# Altium project mod_x_cb_g3399.PrjPCB
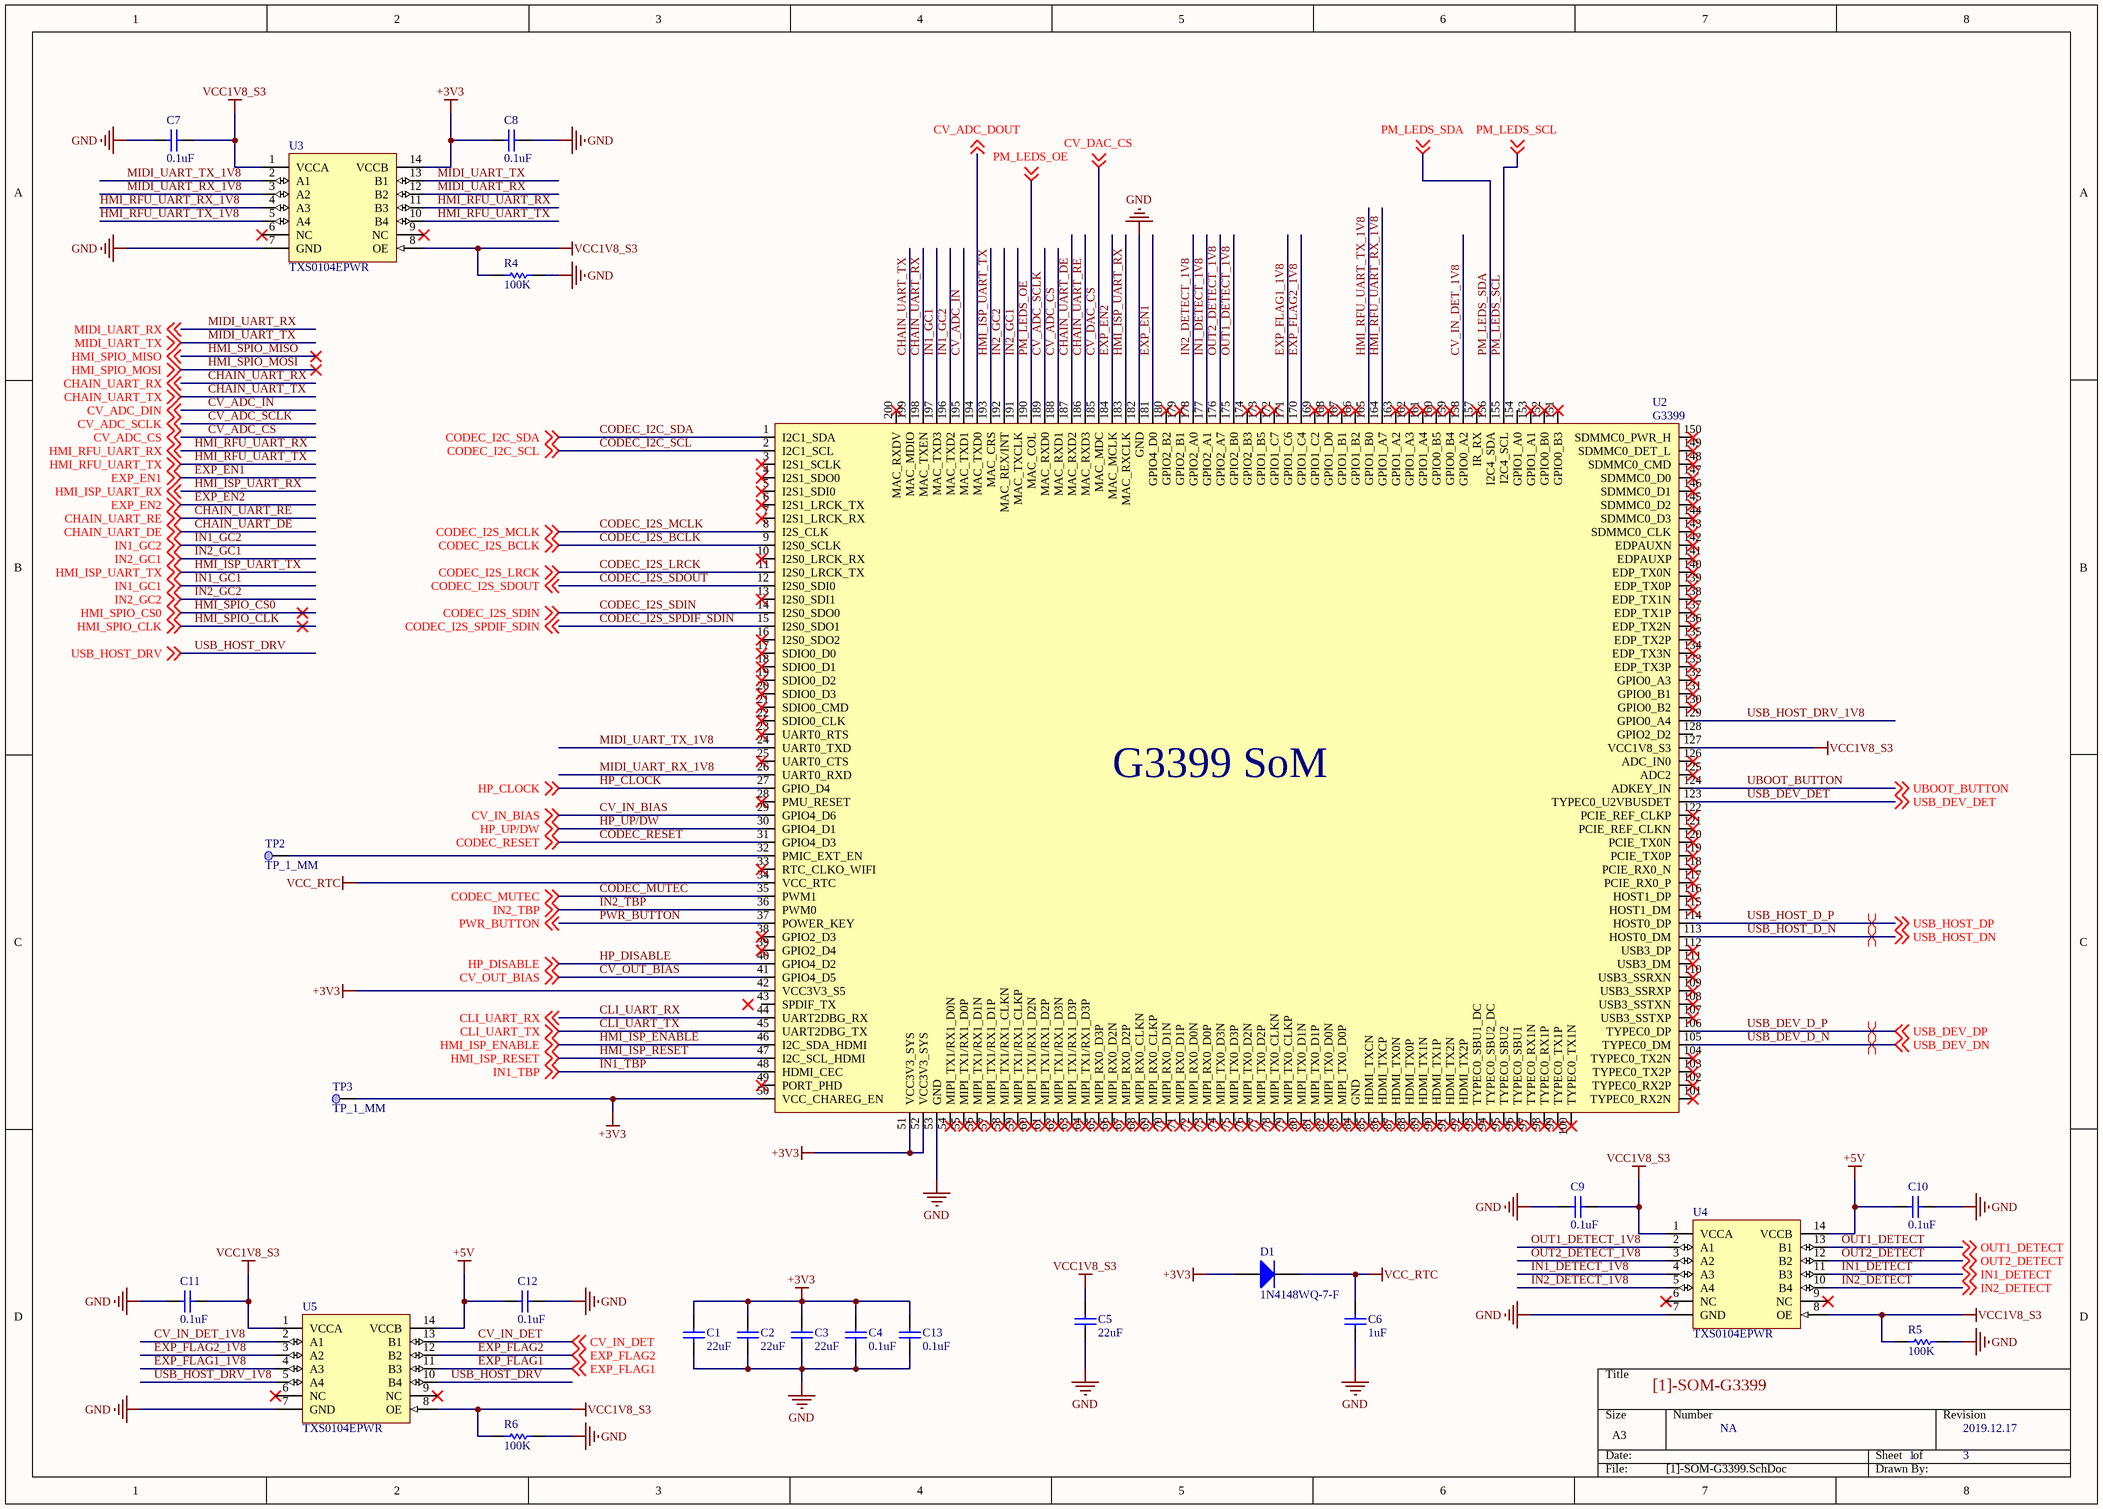
[diagram p0: [1]-SOM-G3399.SchDoc]
3 sheets, 34 parts. Net scope: global (net labels, ports and power ports of the same name join across sheets).
Board file: mod_duo_x_g3399.PcbDoc
Sheets:
  [1]-SOM-G3399.SchDoc
  [2]-INTERFACE_CONNS.SchDoc
  [3]-DCDC-3V3.SchDoc

## Sheet [1]-SOM-G3399.SchDoc: [1]-SOM-G3399
size A3; DocumentNumber: NA; Revision: 2019.12.17; SheetNumber: 1; SheetTotal: 3

### Parts
C1  22uF  [CAPC1608N]
C2  22uF  [CAPC1608N]
C3  22uF  [CAPC1608N]
C4  0.1uF  [CAPC1005N]
C5  22uF  [CAPC1608N]
C6  1uF  [CAPC1005N]
C7  0.1uF  [CAPC1005N]
C8  0.1uF  [CAPC1005N]
C9  0.1uF  [CAPC1005N]
C10  0.1uF  [CAPC1005N]
C11  0.1uF  [CAPC1005N]
C12  0.1uF  [CAPC1005N]
C13  0.1uF  [CAPC1005N]
D1  1N4148WQ-7-F  [SOD123]
R4  100K  [RESC1005N]
R5  100K  [RESC1005N]
R6  100K  [RESC1005N]
TP2  TP_1_MM  [TP_1_MM]  (no BOM)
TP3  TP_1_MM  [TP_1_MM]  (no BOM)
U2  G3399  [G3399-MOD]
U3  TXS0104EPWR  [TSSOP_PW14]
U4  TXS0104EPWR  [TSSOP_PW14]
U5  TXS0104EPWR  [TSSOP_PW14]

### Nets
+3V3: C1.2 C2.2 C3.2 C4.2 C8.2 C13.2 D1.2(A) TP3.1 U2.42(VCC3V3_S5) U2.50(VCC_CHAREG_EN) U2.51(VCC3V3_SYS) U2.52(VCC3V3_SYS) U3.14(VCCB)
+5V: C10.2 C12.2 U4.14(VCCB) U5.14(VCCB)
GND: C1.1 C2.1 C3.1 C4.1 C5.1 C6.1 C7.1 C8.1 C9.1 C10.1 C11.1 C12.1 C13.1 R4.2 R5.2 R6.1 U2.53(GND) U2.182(GND) U3.7(GND) U4.7(GND) U5.7(GND)
VCC1V8_S3: C5.2 C7.2 C9.2 C11.2 R4.1 R5.1 R6.2 U2.127(VCC1V8_S3) U3.1(VCCA) U3.8(OE) U4.1(VCCA) U4.8(OE) U5.1(VCCA) U5.8(OE)
VCC_RTC: C6.2 D1.1(K) U2.34(VCC_RTC)
CHAIN_UART_DE: U2.187(MAC_RXD2) ; off-sheet CHAIN_UART_DE
CHAIN_UART_RE: U2.186(MAC_RXD3) ; off-sheet CHAIN_UART_RE
CHAIN_UART_RX: U2.198(MAC_TXEN) ; off-sheet CHAIN_UART_RX
CHAIN_UART_TX: U2.199(MAC_MDIO) ; off-sheet CHAIN_UART_TX
CLI_UART_RX: U2.44(UART2DBG_RX) ; off-sheet CLI_UART_RX
CLI_UART_TX: U2.45(UART2DBG_TX) ; off-sheet CLI_UART_TX
CODEC_I2C_SCL: U2.2(I2C1_SCL) ; off-sheet CODEC_I2C_SCL
CODEC_I2C_SDA: U2.1(I2C1_SDA) ; off-sheet CODEC_I2C_SDA
CODEC_I2S_BCLK: U2.9(I2S0_SCLK) ; off-sheet CODEC_I2S_BCLK
CODEC_I2S_LRCK: U2.11(I2S0_LRCK_TX) ; off-sheet CODEC_I2S_LRCK
CODEC_I2S_MCLK: U2.8(I2S_CLK) ; off-sheet CODEC_I2S_MCLK
CODEC_I2S_SDIN: U2.14(I2S0_SDO0) ; off-sheet CODEC_I2S_SDIN
CODEC_I2S_SDOUT: U2.12(I2S0_SDI0) ; off-sheet CODEC_I2S_SDOUT
CODEC_I2S_SPDIF_SDIN: U2.15(I2S0_SDO1) ; off-sheet CODEC_I2S_SPDIF_SDIN
CODEC_MUTEC: U2.35(PWM1) ; off-sheet CODEC_MUTEC
CODEC_RESET: U2.31(GPIO4_D3) ; off-sheet CODEC_RESET
CV_ADC_CS: U2.188(MAC_RXD1) ; off-sheet CV_ADC_CS
CV_ADC_DIN: U2.195(MAC_TXD1) ; off-sheet CV_ADC_DIN  [also labelled CV_ADC_IN]
CV_ADC_DOUT: U2.194(MAC_TXD0) ; off-sheet CV_ADC_DOUT
CV_ADC_SCLK: U2.189(MAC_RXD0) ; off-sheet CV_ADC_SCLK
CV_DAC_CS: U2.185(MAC_MDC) ; off-sheet CV_DAC_CS
CV_IN_BIAS: U2.29(GPIO4_D6) ; off-sheet CV_IN_BIAS
CV_IN_DET: U5.13(B1) ; off-sheet CV_IN_DET
CV_IN_DET_1V8: U2.158(GPIO0_A2) U5.2(A1)
CV_OUT_BIAS: U2.41(GPIO4_D5) ; off-sheet CV_OUT_BIAS
EXP_EN1: U2.181(GPIO4_D0) ; off-sheet EXP_EN1
EXP_EN2: U2.184(MAC_MCLK) ; off-sheet EXP_EN2
EXP_FLAG1: U5.11(B3) ; off-sheet EXP_FLAG1
EXP_FLAG1_1V8: U2.171(GPIO1_C6) U5.4(A3)
EXP_FLAG2: U5.12(B2) ; off-sheet EXP_FLAG2
EXP_FLAG2_1V8: U2.170(GPIO1_C4) U5.3(A2)
HMI_ISP_ENABLE: U2.46(I2C_SDA_HDMI) ; off-sheet HMI_ISP_ENABLE
HMI_ISP_RESET: U2.47(I2C_SCL_HDMI) ; off-sheet HMI_ISP_RESET
HMI_ISP_UART_RX: U2.183(MAC_RXCLK) ; off-sheet HMI_ISP_UART_RX
HMI_ISP_UART_TX: U2.193(MAC_CRS) ; off-sheet HMI_ISP_UART_TX
HMI_RFU_UART_RX: U3.11(B3) ; off-sheet HMI_RFU_UART_RX
HMI_RFU_UART_RX_1V8: U2.164(GPIO1_A7) U3.4(A3)
HMI_RFU_UART_TX: U3.10(B4) ; off-sheet HMI_RFU_UART_TX
HMI_RFU_UART_TX_1V8: U2.165(GPIO1_B0) U3.5(A4)
HP_CLOCK: U2.27(GPIO_D4) ; off-sheet HP_CLOCK
HP_DISABLE: U2.40(GPIO4_D2) ; off-sheet HP_DISABLE
HP_UP/DW: U2.30(GPIO4_D1) ; off-sheet HP_UP/DW
IN1_DETECT: U4.11(B3) ; off-sheet IN1_DETECT
IN1_DETECT_1V8: U2.177(GPIO2_A1) U4.4(A3)
IN1_GC1: U2.197(MAC_TXD3) ; off-sheet IN1_GC1
IN1_GC2: U2.196(MAC_TXD2) ; off-sheet IN1_GC2
IN1_TBP: U2.48(HDMI_CEC) ; off-sheet IN1_TBP
IN2_DETECT: U4.10(B4) ; off-sheet IN2_DETECT
IN2_DETECT_1V8: U2.178(GPIO2_A0) U4.5(A4)
IN2_GC1: U2.191(MAC_TXCLK) ; off-sheet IN2_GC1
IN2_GC2: U2.192(MAC_REX/INT) ; off-sheet IN2_GC2
IN2_TBP: U2.36(PWM0) ; off-sheet IN2_TBP
MIDI_UART_RX: U3.12(B2) ; off-sheet MIDI_UART_RX
MIDI_UART_RX_1V8: U2.26(UART0_RXD) U3.3(A2)
MIDI_UART_TX: U3.13(B1) ; off-sheet MIDI_UART_TX
MIDI_UART_TX_1V8: U2.24(UART0_TXD) U3.2(A1)
OUT1_DETECT: U4.13(B1) ; off-sheet OUT1_DETECT
OUT1_DETECT_1V8: U2.175(GPIO2_B0) U4.2(A1)
OUT2_DETECT: U4.12(B2) ; off-sheet OUT2_DETECT
OUT2_DETECT_1V8: U2.176(GPIO2_A7) U4.3(A2)
PM_LEDS_OE: U2.190(MAC_COL) ; off-sheet PM_LEDS_OE
PM_LEDS_SCL: U2.155(I2C4_SCL) ; off-sheet PM_LEDS_SCL
PM_LEDS_SDA: U2.156(I2C4_SDA) ; off-sheet PM_LEDS_SDA
PWR_BUTTON: U2.37(POWER_KEY) ; off-sheet PWR_BUTTON
UBOOT_BUTTON: U2.124(ADKEY_IN) ; off-sheet UBOOT_BUTTON
USB_DEV_D_N: U2.105(TYPEC0_DM) ; off-sheet USB_DEV_DN  [also labelled USB_DEV_DN]
USB_DEV_D_P: U2.106(TYPEC0_DP) ; off-sheet USB_DEV_DP  [also labelled USB_DEV_DP]
USB_DEV_DET: U2.123(TYPEC0_U2VBUSDET) ; off-sheet USB_DEV_DET
USB_HOST_D_N: U2.113(HOST0_DM) ; off-sheet USB_HOST_DN  [also labelled USB_HOST_DN]
USB_HOST_D_P: U2.114(HOST0_DP) ; off-sheet USB_HOST_DP  [also labelled USB_HOST_DP]
USB_HOST_DRV: U5.10(B4) ; off-sheet USB_HOST_DRV
USB_HOST_DRV_1V8: U2.129(GPIO0_A4) U5.5(A4)
NetTP2_1: TP2.1 U2.32(PMIC_EXT_EN)

Not connected (* = marked no-connect by the designer): U2 3(I2S1_SCLK)* 4(I2S1_SDO0)* 5(I2S1_SDI0)* 6(I2S1_LRCK_TX)* 7(I2S1_LRCK_RX)* 10(I2S0_LRCK_RX)* 13(I2S0_SDI1)* 16(I2S0_SDO2)* 17(SDIO0_D0)* 18(SDIO0_D1)* 19(SDIO0_D2)* 20(SDIO0_D3)* 21(SDIO0_CMD)* 22(SDIO0_CLK)* 23(UART0_RTS)* 25(UART0_CTS)* 28(PMU_RESET)* 33(RTC_CLKO_WIFI)* 38(GPIO2_D3)* 39(GPIO2_D4)* 43(SPDIF_TX) 49(PORT_PHD)* 54(MIPI_TX1/RX1_D0N)* 55(MIPI_TX1/RX1_D0P)* 56(MIPI_TX1/RX1_D1N)* 57(MIPI_TX1/RX1_D1P)* 58(MIPI_TX1/RX1_CLKN)* 59(MIPI_TX1/RX1_CLKP)* 60(MIPI_TX1/RX1_D2N)* 61(MIPI_TX1/RX1_D2P)* 62(MIPI_TX1/RX1_D3N)* 63(MIPI_TX1/RX1_D3P)* 64(MIPI_TX1/RX1_D3P)* 65(MIPI_RX0_D3P)* 66(MIPI_RX0_D2N)* 67(MIPI_RX0_D2P)* 68(MIPI_RX0_CLKN)* 69(MIPI_RX0_CLKP)* 70(MIPI_RX0_D1N)* 71(MIPI_RX0_D1P)* 72(MIPI_RX0_D0N)* 73(MIPI_RX0_D0P)* 74(MIPI_TX0_D3N)* 75(MIPI_TX0_D3P)* 76(MIPI_TX0_D2N)* 77(MIPI_TX0_D2P)* 78(MIPI_TX0_CLKN)* 79(MIPI_TX0_CLKP)* 80(MIPI_TX0_D1N)* 81(MIPI_TX0_D1P)* 82(MIPI_TX0_D0N)* 83(MIPI_TX0_D0P)* 84(GND)* 85(HDMI_TXCN)* 86(HDMI_TXCP)* 87(HDMI_TX0N)* 88(HDMI_TX0P)* 89(HDMI_TX1N)* 90(HDMI_TX1P)* 91(HDMI_TX2N)* 92(HDMI_TX2P)* 93(TYPEC0_SBU1_DC)* 94(TYPEC0_SBU2_DC)* 95(TYPEC0_SBU2)* 96(TYPEC0_SBU1)* 97(TYPEC0_RX1N)* 98(TYPEC0_RX1P)* 99(TYPEC0_TX1P)* 100(TYPEC0_TX1N)* 101(TYPEC0_RX2N)* 102(TYPEC0_RX2P)* 103(TYPEC0_TX2P)* 104(TYPEC0_TX2N)* 107(USB3_SSTXP)* 108(USB3_SSTXN)* 109(USB3_SSRXP)* 110(USB3_SSRXN)* 111(USB3_DM)* 112(USB3_DP)* 115(HOST1_DM)* 116(HOST1_DP)* 117(PCIE_RX0_P)* 118(PCIE_RX0_N)* 119(PCIE_TX0P)* 120(PCIE_TX0N)* 121(PCIE_REF_CLKN)* 122(PCIE_REF_CLKP)* 125(ADC2)* 126(ADC_IN0)* 128(GPIO2_D2) 130(GPIO0_B2)* 131(GPIO0_B1)* 132(GPIO0_A3)* 133(EDP_TX3P)* 134(EDP_TX3N)* 135(EDP_TX2P)* 136(EDP_TX2N)* 137(EDP_TX1P)* 138(EDP_TX1N)* 139(EDP_TX0P)* 140(EDP_TX0N)* 141(EDPAUXP)* 142(EDPAUXN)* 143(SDMMC0_CLK)* 144(SDMMC0_D3)* 145(SDMMC0_D2)* 146(SDMMC0_D1)* 147(SDMMC0_D0)* 148(SDMMC0_CMD)* 149(SDMMC0_DET_L)* 150(SDMMC0_PWR_H)* 151(GPIO0_B3)* 152(GPIO0_B0)* 153(GPIO1_A1)* 154(GPIO1_A0) 157(IR_RX)* 159(GPIO0_B4)* 160(GPIO0_B5)* 161(GPIO1_A4)* 162(GPIO1_A3)* 163(GPIO1_A2)* 166(GPIO1_B2)* 167(GPIO1_B1)* 168(GPIO1_D0)* 169(GPIO1_C2)* 172(GPIO1_C7)* 173(GPIO1_B5)* 174(GPIO2_B3)* 179(GPIO2_B1)* 180(GPIO2_B2)* 200(MAC_RXDV)*; U3 6(NC)* 9(NC)*; U4 6(NC)* 9(NC)*; U5 6(NC)* 9(NC)*

### Layout directives
differential pair: USB_DEV_D_N, USB_DEV_D_P, USB_HOST_D_N, USB_HOST_D_P

### Notes on the sheet
- (in symbol G3399) G3399 SoM

### Library data of the parts
C1-C3 C5 = GRM188R60J226MEA0D: CAP CER 22UF 6.3V X5R 0603; Manufacturer 1: Murata; Tolerance: 20%; Supplier 1: Digi-Key; Manufacturer Part Number 1: GRM188R60J226MEA0D; Stock 1: 40000; Pricing 1: 1=0.26, 10=0.177, 100=0.1001, 500=0.07066, 1000=0.06182 (USD); Mount: Surface Mount; Case/Package: 0603; Weight: 0.000222oz; Case Code (Metric): 1608; Case Code (Imperial): 0603; Min Operating Temperature: -55°C; Max Operating Temperature: 85°C; Capacitance: 22uF; Packaging: Tape and Reel; Package Quantity: 4000; Voltage Rating: 6.3V; Dielectric: X5R; Termination: SMD/SMT; Voltage Rating (DC): 6.3V; Length: 1.6mm; Height: 0.8mm; Width: 0.8mm; Thickness: 0.039inch; Depth: 0.8mm; REACH SVHC: No SVHC; Lead Free: Lead Free; ComponentLink1URL: https://www.murata.com/~/media/webrenewal/support/library/catalog/products/capacitor/mlcc/c02e.ashx?la=en-us; ComponentLink1Description: https://www.murata.com/~/media/webrenewal/support/library/catalog/products/capacitor/mlcc/c02e.ashx?la=en-us; Supplier Part Number 1: 490-7611-1-ND
C4 C7-C13 = GRM155R71H104KE14D: CAP CER 0.1UF 50V X7R 0402; Manufacturer 1: Murata; Description 1: Cap Ceramic 0.1uF 50V X7R 10% SMD 0402 125C Paper T/R; Voltage Rating DC: 50 VDC; Tolerance: 10 %; Brand: Murata Electronics; Capacitance - nF: 100 nF; Capacitance - pF: 100000 pF; Class: Class 2; Type: General Purpose Ceramic Capacitors; Unit Weight: 0.000212 oz; Supplier 1: Digi-Key; Manufacturer Part Number 1: GRM155R71H104KE14D; Stock 1: 0; Pricing 1: 1=0.1, 10=0.022, 100=0.0099, 500=0.0071, 1000=0.0056, 2500=0.0051, 5000=0.0047 (USD); Product Category: Multilayer Ceramic Capacitors MLCC - SMD/SMT; RoHS: True; Capacitance: 0.1 uF; Dielectric: X7R; Case Code - in: 0402; Case Code - mm: 1005; Height: 0.5 mm; Maximum Operating Temperature: + 125 C; Minimum Operating Temperature: - 55 C; Product: General Type MLCCs; Series: GRM; Packaging: Reel; Length: 1 mm; Package / Case: 0402 (1005 metric); Factory Pack Quantity: 10000; Termination Style: SMD/SMT; Width: 0.5 mm; ComponentLink1URL: http://components.arrow.com/part/dataview/0323_07030614; ComponentLink1Description: http://components.arrow.com/part/dataview/0323_07030614; ComponentLink2URL: http://psearch.en.murata.com/capacitor/product/GRM155R71H104KE14%23.pdf; ComponentLink2Description: http://psearch.en.murata.com/capacitor/product/GRM155R71H104KE14%23.pdf; ComponentLink3URL: http://www.mouser.com/ds/2/281/c02e-2905.pdf; ComponentLink3Description: http://www.mouser.com/ds/2/281/c02e-2905.pdf; ComponentLink4URL: http://search.murata.co.jp/Ceramy/image/img/A01X/partnumbering_e_01.pdf; ComponentLink4Description: http://search.murata.co.jp/Ceramy/image/img/A01X/partnumbering_e_01.pdf; ComponentLink5URL: http://www.farnell.com/datasheets/2079156.pdf; ComponentLink5Description: http://www.farnell.com/datasheets/2079156.pdf; Supplier Part Number 1: 490-10700-1-ND
C6 = C0402C105K9PACTU: CAP CER 1UF 6.3V X5R 0402; Manufacturer 1: KEMET; Product Training Modules: Capacitor Basics- Typical Uses for Capacitors; Capacitance: 1µF; Tolerance: ±10%; Online Catalog: X5R Dielectric (Commercial Grade); Kits: 399-5085-ND  - KIT CER HI CAPACITANCE CHIP CAPS; Other Names: 399-4873-1; Supplier 1: Digi-Key; Manufacturer Part Number 1: C0402C105K9PACTU; Description 1: CAP CER 1UF 6.3V X5R 0402; Stock 1: 0; Pricing 1: 1=0.1, 10=0.022, 100=0.0097, 500=0.007, 1000=0.0055, 2500=0.005, 5000=0.0046 (USD); Standard Package: 1; Category: Capacitors; Family: Ceramic Capacitors; Series: C; Packaging: Cut Tape (CT); Voltage - Rated: 6.3V; Temperature Coefficient: X5R; Mounting Type: Surface Mount, MLCC; Operating Temperature: -55°C ~ 85°C; Applications: General Purpose; Ratings: -; Package / Case: 0402 (1005 Metric); Size / Dimension: 0.039" L x 0.020" W (1.00mm x 0.50mm); Height - Seated (Max): -; Thickness (Max): 0.022" (0.55mm); Lead Spacing: -; Features: -; Lead Style: -; ComponentLink1URL: https://datasheet.ciiva.com/144/docfinderpartnumber-c0402c105k9pactu-144529.pdf; ComponentLink1Description: https://datasheet.ciiva.com/144/docfinderpartnumber-c0402c105k9pactu-144529.pdf; ComponentLink2URL: https://datasheet.ciiva.com/28645/1789732-28645392.pdf; ComponentLink2Description: https://datasheet.ciiva.com/28645/1789732-28645392.pdf; ComponentLink3URL: https://datasheet.ciiva.com/7747/40889-7747623.pdf; ComponentLink3Description: https://datasheet.ciiva.com/7747/40889-7747623.pdf; ComponentLink4URL: https://datasheet.ciiva.com/18192/getdatasheetpartid-127800-18192427.pdf; ComponentLink4Description: https://datasheet.ciiva.com/18192/getdatasheetpartid-127800-18192427.pdf; ComponentLink5URL: https://datasheet.ciiva.com/7747/kem-c1006-x5r-smd-7747445.pdf; ComponentLink5Description: https://datasheet.ciiva.com/7747/kem-c1006-x5r-smd-7747445.pdf; ComponentLink6URL: https://datasheet.ciiva.com/5414/kem-c1006-x5r-smd-5414919.pdf; ComponentLink6Description: https://datasheet.ciiva.com/5414/kem-c1006-x5r-smd-5414919.pdf; Supplier Part Number 1: 399-4873-1-ND
D1 = 1N4148WQ-7-F: DIODE GEN PURP 100V 300MA SOD123; Manufacturer 1: Diodes Zetex; Max Surge Current: 2A; Forward Voltage: 1.25V; Element Configuration: Single; Recovery Time: 4ns; Peak Reverse Current: 50uA; Max Power Dissipation: 400mW; Supplier 1: Digi-Key; Manufacturer Part Number 1: 1N4148WQ-7-F; Stock 1: 65303; Pricing 1: 1=0.22, 10=0.196, 100=0.107, 500=0.06582, 1000=0.04488 (USD); Mount: Surface Mount; Case/Package: SOD-123-2; Number of Pins: 2; Weight: 0.000353oz; Contact Plating: Matte,Tin; Min Operating Temperature: -65°C; Max Operating Temperature: 150°C; Packaging: Tape and Reel; Peak Non-Repetitive Surge Current: 2A; Forward Current: 300mA; Package Quantity: 3000; Reverse Recovery Time: 4ns; Max Repetitive Reverse Voltage (Vrrm): 100V; Lead Free: Lead Free; Supplier Part Number 1: 1N4148WQ-7-FDICT-ND
R4-R6 = RC0402FR-07100KL: RES SMD 100K OHM 1% 1/16W 0402; Manufacturer 1: Yageo; Resistance: 100 kOhms; Power Rating: 62.5 mW (1/16 W); Voltage Rating: 50 V; Temperature Coefficient: 100 PPM / C; Supplier 1: Digi-Key; Manufacturer Part Number 1: RC0402FR-07100KL; Description 1: RES SMD 100K OHM 1% 1/16W 0402; Stock 1: 10691398; Pricing 1: 1=0.1, 10=0.014, 100=0.0056, 1000=0.0025, 2500=0.0022, 5000=0.0018 (USD); Termination Style: SMD/SMT; Product: Thick Film Resistors General Purpose; Tolerance: 1 %; Case Code - in: 0402; Case Code - mm: 1005; Series: RC; Operating Temperature Range: - 55 C to + 155 C; Packaging: Reel; ComponentLink1URL: https://datasheet.ciiva.com/11819/0900766b80c66297-11819452.pdf; ComponentLink1Description: https://datasheet.ciiva.com/11819/0900766b80c66297-11819452.pdf; ComponentLink2URL: https://datasheet.ciiva.com/16740/pyu-rc0402-51-rohs-l-6-r-16740567.pdf; ComponentLink2Description: https://datasheet.ciiva.com/16740/pyu-rc0402-51-rohs-l-6-r-16740567.pdf; ComponentLink3URL: https://datasheet.ciiva.com/12667/pyu-rc0402-51-rohs-l-6-r-12667930.pdf; ComponentLink3Description: https://datasheet.ciiva.com/12667/pyu-rc0402-51-rohs-l-6-r-12667930.pdf; ComponentLink4URL: https://datasheet.ciiva.com/2453/pyu-r-int-thick-7-2453361.pdf; ComponentLink4Description: https://datasheet.ciiva.com/2453/pyu-r-int-thick-7-2453361.pdf; ComponentLink5URL: https://datasheet.ciiva.com/15189/getdatasheetpartid-323696-15189334.pdf; ComponentLink5Description: https://datasheet.ciiva.com/15189/getdatasheetpartid-323696-15189334.pdf; ComponentLink6URL: https://datasheet.ciiva.com/2453/pyu-r-int-thick-7-2453362.pdf; ComponentLink6Description: https://datasheet.ciiva.com/2453/pyu-r-int-thick-7-2453362.pdf; ComponentLink7URL: https://datasheet.ciiva.com/2453/pyu-r-int-thick-7-2453363.pdf; ComponentLink7Description: https://datasheet.ciiva.com/2453/pyu-r-int-thick-7-2453363.pdf; ComponentLink8URL: https://datasheet.ciiva.com/22747/1018594-22747509.pdf; ComponentLink8Description: https://datasheet.ciiva.com/22747/1018594-22747509.pdf; Supplier Part Number 1: 311-100KLRCT-ND
U2 = G3399: ROCKCHIP R3399 SoM
U3-U5 = IC_TXS0104EPWRG4: IC TRNSLTR BIDIRECTIONAL 14TSSOP; Manufacturer 1: Texas Instruments; Max Supply Voltage: 5.5V; Min Supply Voltage: 2.3V; Propagation Delay: 260ns; Data Rate: 24Mbps; Number of Channels: 4; Logic Function: Translator; High Level Output Current: -20uA; Low Level Output Current: 1mA; Quiescent Current: 14.4uA; Output Type: Voltage; Supplier 1: Digi-Key; Stock 1: 1124; Pricing 1: 1=1.35000, 10=1.20300, 100=0.93810, 500=0.77498, 1000=0.61182 (USD); RoHS: Yes; Mount: Surface Mount; Case/Package: TSSOP; Number of Pins: 14; Weight: 0.002018oz; Min Operating Temperature: -40°C; Max Operating Temperature: 85°C; Packaging: Tape and Reel; Package Quantity: 2000; Number of Bits: 4; Turn-On Delay Time: 260ns; Length: 5mm; Height: 1.15mm; Width: 4.4mm; Radiation Hardening: No; Lead Free: Lead Free; ComponentLink1URL: https://datasheet.ciiva.com/4834/sces651d-126957-4834816.pdf?src-supplier=Mouser; ComponentLink1Description: https://datasheet.ciiva.com/4834/sces651d-126957-4834816.pdf?src-supplier=Mouser; ComponentLink2URL: https://datasheet.ciiva.com/15096/getdatasheetpartid-394723-15096293.pdf?src-supplier=Verical; ComponentLink2Description: https://datasheet.ciiva.com/15096/getdatasheetpartid-394723-15096293.pdf?src-supplier=Verical; ComponentLink3URL: https://datasheet.ciiva.com/26039/txs0104e-26039590.pdf?src-supplier=Avnet+Europe; ComponentLink3Description: https://datasheet.ciiva.com/26039/txs0104e-26039590.pdf?src-supplier=Avnet+Europe; ComponentLink4URL: https://datasheet.ciiva.com/14287/txs0104e-14287679.pdf?src-supplier=Avnet; ComponentLink4Description: https://datasheet.ciiva.com/14287/txs0104e-14287679.pdf?src-supplier=Avnet; ComponentLink5URL: https://datasheet.ciiva.com/1900/txs0104e-1900897.pdf?src-supplier=Digi-Key; ComponentLink5Description: https://datasheet.ciiva.com/1900/txs0104e-1900897.pdf?src-supplier=Digi-Key; Supplier Part Number 1: 296-52841-1-ND; Manufacturer Part Number 1: TXS0104EPWRG4

## Sheet [2]-INTERFACE_CONNS.SchDoc: [2]-INTERFACE_CONNS
size A3; DocumentNumber: NA; Revision: 2019.12.17; SheetNumber: 2; SheetTotal: 3
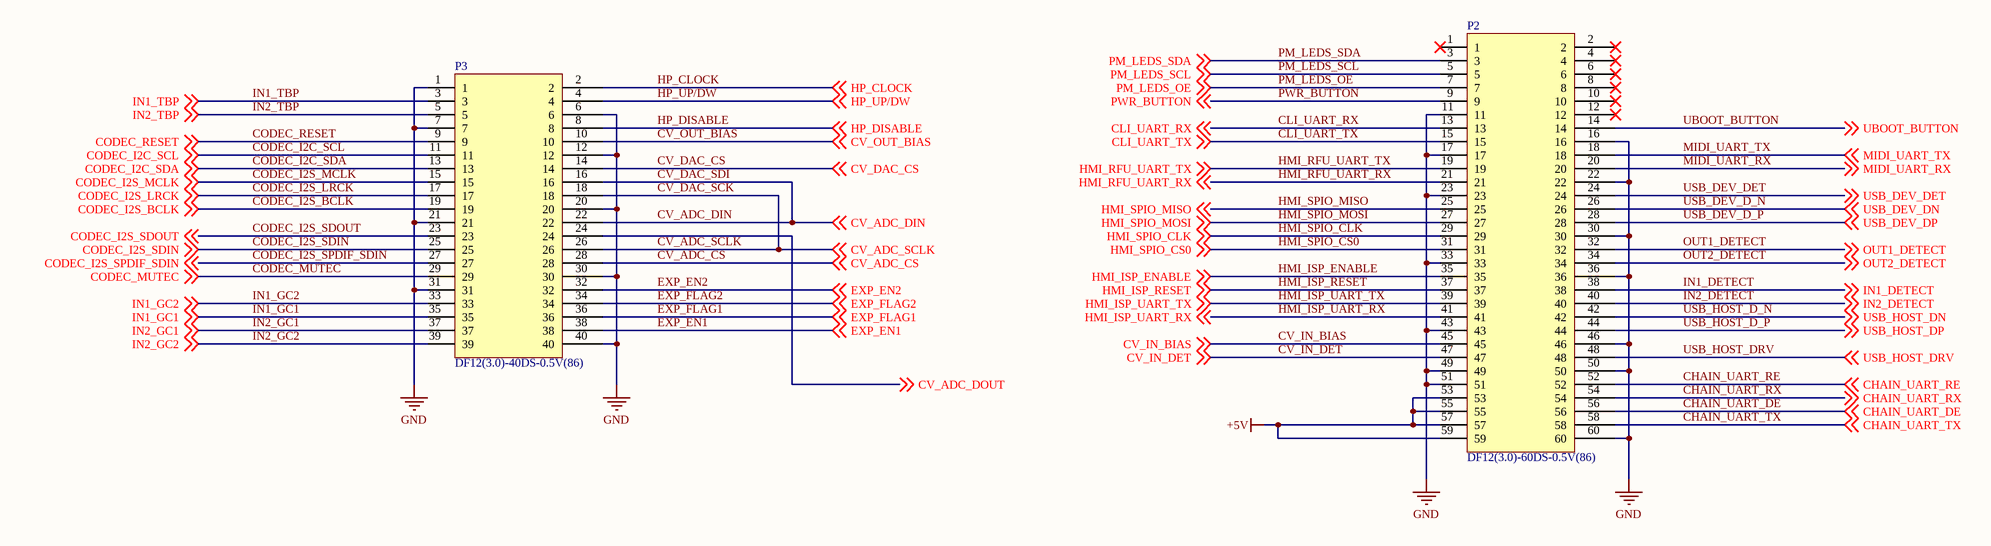
[diagram p1: [2]-INTERFACE_CONNS.SchDoc]

### Parts
P2  DF12(3.0)-60DS-0.5V(86)  [DF12-60]
P3  DF12(3.0)-40DS-0.5V(86)  [DF12-40]

### Nets
+5V: P2.53 P2.55 P2.57 P2.59
GND: P2.11 P2.16 P2.17 P2.22 P2.23 P2.30 P2.33 P2.36 P2.43 P2.46 P2.49 P2.50 P2.51 P2.60 P3.1 P3.6 P3.7 P3.12 P3.20 P3.21 P3.30 P3.31 P3.40
CHAIN_UART_DE: P2.56 ; off-sheet CHAIN_UART_DE
CHAIN_UART_RE: P2.52 ; off-sheet CHAIN_UART_RE
CHAIN_UART_RX: P2.54 ; off-sheet CHAIN_UART_RX
CHAIN_UART_TX: P2.58 ; off-sheet CHAIN_UART_TX
CLI_UART_RX: P2.13 ; off-sheet CLI_UART_RX
CLI_UART_TX: P2.15 ; off-sheet CLI_UART_TX
CODEC_I2C_SCL: P3.11 ; off-sheet CODEC_I2C_SCL
CODEC_I2C_SDA: P3.13 ; off-sheet CODEC_I2C_SDA
CODEC_I2S_BCLK: P3.19 ; off-sheet CODEC_I2S_BCLK
CODEC_I2S_LRCK: P3.17 ; off-sheet CODEC_I2S_LRCK
CODEC_I2S_MCLK: P3.15 ; off-sheet CODEC_I2S_MCLK
CODEC_I2S_SDIN: P3.25 ; off-sheet CODEC_I2S_SDIN
CODEC_I2S_SDOUT: P3.23 ; off-sheet CODEC_I2S_SDOUT
CODEC_I2S_SPDIF_SDIN: P3.27 ; off-sheet CODEC_I2S_SPDIF_SDIN
CODEC_MUTEC: P3.29 ; off-sheet CODEC_MUTEC
CODEC_RESET: P3.9 ; off-sheet CODEC_RESET
CV_ADC_CS: P3.28 ; off-sheet CV_ADC_CS
CV_ADC_DIN: P3.16 P3.22 ; off-sheet CV_ADC_DIN  [also labelled CV_DAC_SDI]
CV_ADC_DOUT: P3.24 ; off-sheet CV_ADC_DOUT
CV_ADC_SCLK: P3.18 P3.26 ; off-sheet CV_ADC_SCLK  [also labelled CV_DAC_SCK]
CV_DAC_CS: P3.14 ; off-sheet CV_DAC_CS
CV_IN_BIAS: P2.45 ; off-sheet CV_IN_BIAS
CV_IN_DET: P2.47 ; off-sheet CV_IN_DET
CV_OUT_BIAS: P3.10 ; off-sheet CV_OUT_BIAS
EXP_EN1: P3.38 ; off-sheet EXP_EN1
EXP_EN2: P3.32 ; off-sheet EXP_EN2
EXP_FLAG1: P3.36 ; off-sheet EXP_FLAG1
EXP_FLAG2: P3.34 ; off-sheet EXP_FLAG2
HMI_ISP_ENABLE: P2.35 ; off-sheet HMI_ISP_ENABLE
HMI_ISP_RESET: P2.37 ; off-sheet HMI_ISP_RESET
HMI_ISP_UART_RX: P2.41 ; off-sheet HMI_ISP_UART_RX
HMI_ISP_UART_TX: P2.39 ; off-sheet HMI_ISP_UART_TX
HMI_RFU_UART_RX: P2.21 ; off-sheet HMI_RFU_UART_RX
HMI_RFU_UART_TX: P2.19 ; off-sheet HMI_RFU_UART_TX
HMI_SPIO_CLK: P2.29 ; off-sheet HMI_SPIO_CLK
HMI_SPIO_CS0: P2.31 ; off-sheet HMI_SPIO_CS0
HMI_SPIO_MISO: P2.25 ; off-sheet HMI_SPIO_MISO
HMI_SPIO_MOSI: P2.27 ; off-sheet HMI_SPIO_MOSI
HP_CLOCK: P3.2 ; off-sheet HP_CLOCK
HP_DISABLE: P3.8 ; off-sheet HP_DISABLE
HP_UP/DW: P3.4 ; off-sheet HP_UP/DW
IN1_DETECT: P2.38 ; off-sheet IN1_DETECT
IN1_GC1: P3.35 ; off-sheet IN1_GC1
IN1_GC2: P3.33 ; off-sheet IN1_GC2
IN1_TBP: P3.3 ; off-sheet IN1_TBP
IN2_DETECT: P2.40 ; off-sheet IN2_DETECT
IN2_GC1: P3.37 ; off-sheet IN2_GC1
IN2_GC2: P3.39 ; off-sheet IN2_GC2
IN2_TBP: P3.5 ; off-sheet IN2_TBP
MIDI_UART_RX: P2.20 ; off-sheet MIDI_UART_RX
MIDI_UART_TX: P2.18 ; off-sheet MIDI_UART_TX
OUT1_DETECT: P2.32 ; off-sheet OUT1_DETECT
OUT2_DETECT: P2.34 ; off-sheet OUT2_DETECT
PM_LEDS_OE: P2.7 ; off-sheet PM_LEDS_OE
PM_LEDS_SCL: P2.5 ; off-sheet PM_LEDS_SCL
PM_LEDS_SDA: P2.3 ; off-sheet PM_LEDS_SDA
PWR_BUTTON: P2.9 ; off-sheet PWR_BUTTON
UBOOT_BUTTON: P2.14 ; off-sheet UBOOT_BUTTON
USB_DEV_D_N: P2.26 ; off-sheet USB_DEV_DN  [also labelled USB_DEV_DN]
USB_DEV_D_P: P2.28 ; off-sheet USB_DEV_DP  [also labelled USB_DEV_DP]
USB_DEV_DET: P2.24 ; off-sheet USB_DEV_DET
USB_HOST_D_N: P2.42 ; off-sheet USB_HOST_DN  [also labelled USB_HOST_DN]
USB_HOST_D_P: P2.44 ; off-sheet USB_HOST_DP  [also labelled USB_HOST_DP]
USB_HOST_DRV: P2.48 ; off-sheet USB_HOST_DRV

Not connected (* = marked no-connect by the designer): P2 1* 2* 4* 6* 8* 10* 12*

### Library data of the parts
P2 = DF12(3.0)-60DS-0.5V(86): CONN RECEPT 60POS 3MM SMD 0.5MM; Manufacturer 1: Hirose; Number of Contacts: 60; Current Rating: 300mA; Voltage Rating: 50V; Gender: Receptacle; Contact Resistance: 50mR; Mating Cycles: 50; Insulation Resistance: 500MR; Row Spacing: 2.4mm; Supplier 1: Digi-Key; Manufacturer Part Number 1: DF12(3.0)-60DS-0.5V(86); Stock 1: 7229; Pricing 1: 1=1.87, 10=1.698, 25=1.594, 50=1.5246, 100=1.4553, 250=1.31672, 500=1.21276 (USD); Mount: Surface Mount; Contact Plating: Gold; Contact Material: Copper,Copper Alloy; Housing Colour: Beige; Housing Material: Polyamide; Insulation Material: Nylon; Colour: Beige; Min Operating Temperature: -45°C; Max Operating Temperature: 125°C; Number of Rows: 2; Termination: Solder; Packaging: Tape and Reel; Package Quantity: 1; Number of Positions: 60; Orientation: Straight; Max Current Rating: 300mA; Max Voltage Rating (AC): 50V; Voltage Rating (AC): 50V; Connector Type: Receptacle; Length: 18mm; Pitch: 0.5mm; Stack Height: 3mm; Mated Stacking Heights: 3mm; Depth: 3.6mm; Lead Pitch: 0.5mm; Width: 18mm; Radiation Hardening: No; Flammability Rating: UL94 V-0; REACH SVHC: No SVHC; Lead Free: Lead Free; Supplier Part Number 1: H5207CT-ND
P3 = DF12(3.0)-40DS-0.5V(86): CONN RECEPT 40POS 3MM SMD 0.5MM; Manufacturer 1: Hirose; Number of Contacts: 40; Current Rating: 300mA; Voltage Rating: 50V; Gender: Receptacle; Contact Resistance: 50mR; Row Spacing: 2.4mm; Supplier 1: Digi-Key; Manufacturer Part Number 1: DF12(3.0)-40DS-0.5V(86); Stock 1: 9904; Pricing 1: 1=1.44, 10=1.262, 25=1.188, 50=1.1386, 100=1.089, 250=0.99, 500=0.891 (USD); Mount: Surface Mount; Contact Plating: Gold; Contact Material: Copper; Housing Colour: Beige; Housing Material: Polyamide; Insulation Material: Nylon; Min Operating Temperature: -45°C; Max Operating Temperature: 125°C; Number of Rows: 2; Termination: SMD/SMT; Packaging: Tape and Reel; Package Quantity: 1000; Number of Positions: 40; Orientation: Straight; Connector Type: Receptacle; Max Current Rating: 300mA; Max Voltage Rating (AC): 50V; Length: 13mm; Pitch: 0.5mm; Mated Stacking Heights: 3mm; Stack Height: 3mm; Depth: 3.6mm; Radiation Hardening: No; Lead Free: Lead Free; Flammability Rating: UL94 V-0; REACH SVHC: No SVHC; Supplier Part Number 1: H11706CT-ND

## Sheet [3]-DCDC-3V3.SchDoc: [3]-DCDC-3V3
size A3; DocumentNumber: NA; Revision: 2019.12.17; SheetNumber: 3; SheetTotal: 3
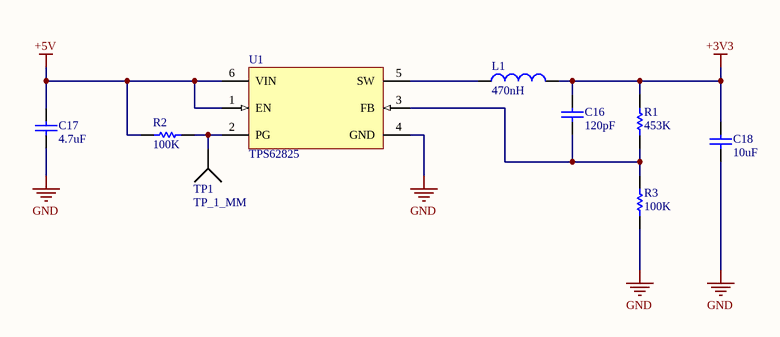
[diagram p2: [3]-DCDC-3V3.SchDoc]

### Parts
C16  120pF  [CAPC1005N]
C17  4.7uF  [CAPC2012N]
C18  10uF  [CAPC2012N]
L1  470nH  [IHLP-1212AE-11]
R1  453K  [RESC1005N]
R2  100K  [RESC1005N]
R3  100K  [RESC1005N]
TP1  TP_1_MM  [TP_1_MM]  (no BOM)
U1  TPS62825  [DMQ0006A]

### Nets
+3V3: C16.2 C18.2 L1.2 R1.2
+5V: C17.2 R2.1 U1.1(EN) U1.6(VIN)
GND: C17.1 C18.1 R3.1 U1.4(GND)
NetC16_1: C16.1 R1.1 R3.2 U1.3(FB)
NetL1_1: L1.1 U1.5(SW)
NetR2_2: R2.2 TP1.1 U1.2(PG)

### Library data of the parts
C16 = GRM1555C1H121FA01D: CAP CER 120PF 50V C0G/NP0 0402; Manufacturer 1: Murata; Description 1: Multilayer Ceramic Capacitors MLCC - SMD/SMT 0402 120pF 50volts 1%; Brand: Murata Electronics; Tolerance: 1 %; Dielectric: C0G (NP0); Case Height: 0.5 mm; Case Length: 1 mm; Temperature Coefficient / Code: +/- 30 PPM / C; Type: General Purpose MLCC; Material: Ceramic; Temperature Coefficient: 30ppm/°C; Supplier 1: Digi-Key; Stock 1: 154558; Pricing 1: 1=0.15, 10=0.107, 100=0.0501, 500=0.0351, 1000=0.0291, 2500=0.0271, 5000=0.0248 (USD); Voltage Rating: 50 V; Product Category: Multilayer Ceramic Capacitors MLCC - SMD/SMT; RoHS: Details; Capacitance: 120 pF; Voltage Rating DC: 50 V; Case Code - in: 0402; Case Code - mm: 1005; Minimum Operating Temperature: - 55 C; Maximum Operating Temperature: + 125 C; Product: General Type MLCCs; Case Width: 0.5 mm; Operating Temperature Range: - 55 C to + 125 C; Package / Case: 0402 (1005 metric); Packaging: Reel; Series: GRM; Factory Pack Quantity: 10000; Termination Style: SMD/SMT; Dimensions: 0.5 mm W x 1 mm L x 0.5 mm H; ComponentLink1URL: https://datasheet.ciiva.com/11617/c02e-11617455.pdf; ComponentLink1Description: https://datasheet.ciiva.com/11617/c02e-11617455.pdf; ComponentLink2URL: https://datasheet.ciiva.com/17451/c02e-17451502.pdf; ComponentLink2Description: https://datasheet.ciiva.com/17451/c02e-17451502.pdf; Supplier Part Number 1: 490-8182-1-ND; Supplier 2: Digi-Key; Manufacturer 2: Murata; Manufacturer Part Number 2: GRM1555C1H121JA01D; Stock 2: 100000; Pricing 2: 1=0.1, 10=0.065, 100=0.0289, 500=0.02066, 1000=0.01623, 2500=0.01475, 5000=0.01357 (USD); Mount: Surface Mount; Case/Package: 0402; Case Code (Imperial): 0402; Case Code (Metric): 1005; Min Operating Temperature: -55°C; Max Operating Temperature: 125°C; Voltage Rating (DC): 50V; Package Quantity: 1; Termination: SMD/SMT; Voltage: 50V; Length: 1mm; Height: 0.5mm; Width: 0.5mm; Thickness: 0.022inch; Depth: 0.5mm; Radiation Hardening: No; REACH SVHC: No SVHC; Lead Free: Lead Free; Manufacturer Part Number 1: GRM1555C1H121FA01D; Supplier Part Number 2: 490-1292-1-ND
C17 = C2012X5R1E475K125AB: CAP CER 4.7UF 25V X5R 0805; Manufacturer 1: TDK; Dielectric Material: Ceramic; Tolerance: 10%; Supplier 1: Digi-Key; Manufacturer Part Number 1: C2012X5R1E475K125AB; Stock 1: 20000; Pricing 1: 1=0.38, 10=0.259, 100=0.1466, 500=0.1035, 1000=0.09056 (USD); Mount: Surface Mount; Case/Package: 0805; Number of Pins: 2; Weight: 0.000194oz; Case Code (Imperial): 0805; Case Code (Metric): 2012; Min Operating Temperature: -55°C; Max Operating Temperature: 85°C; Capacitance: 4.7uF; Dielectric: X5R; Voltage Rating: 25V; Voltage Rating (DC): 25V; Packaging: Tape and Reel; Package Quantity: 1; Termination: SMD/SMT; Composition: Ceramic; Voltage: 25V; Length: 2mm; Height: 1.25mm; Depth: 1.25mm; Width: 1.25mm; Thickness: 0.057inch; Radiation Hardening: No; REACH SVHC: No SVHC; Lead Free: Lead Free; ComponentLink1URL: https://datasheet.ciiva.com/24216/tdkmlcccaprange-24216480.pdf; ComponentLink1Description: https://datasheet.ciiva.com/24216/tdkmlcccaprange-24216480.pdf; ComponentLink2URL: https://datasheet.ciiva.com/11788/0900766b80c1bb00-11788107.pdf; ComponentLink2Description: https://datasheet.ciiva.com/11788/0900766b80c1bb00-11788107.pdf; ComponentLink3URL: https://datasheet.ciiva.com/36857/1796654-36857301.pdf; ComponentLink3Description: https://datasheet.ciiva.com/36857/1796654-36857301.pdf; ComponentLink4URL: https://datasheet.ciiva.com/22773/1571323-22773430.pdf; ComponentLink4Description: https://datasheet.ciiva.com/22773/1571323-22773430.pdf; ComponentLink5URL: https://datasheet.ciiva.com/6251/tdkmlcccaprange-6251817.pdf; ComponentLink5Description: https://datasheet.ciiva.com/6251/tdkmlcccaprange-6251817.pdf; ComponentLink6URL: https://datasheet.ciiva.com/22676/1571323-22676937.pdf; ComponentLink6Description: https://datasheet.ciiva.com/22676/1571323-22676937.pdf; ComponentLink7URL: https://datasheet.ciiva.com/6251/tdkmlcccaprange-6251820.pdf; ComponentLink7Description: https://datasheet.ciiva.com/6251/tdkmlcccaprange-6251820.pdf; ComponentLink8URL: https://datasheet.ciiva.com/28602/1744655-28602173.pdf; ComponentLink8Description: https://datasheet.ciiva.com/28602/1744655-28602173.pdf; ComponentLink9URL: https://datasheet.ciiva.com/6251/tdkmlcccaprange-6251823.pdf; ComponentLink9Description: https://datasheet.ciiva.com/6251/tdkmlcccaprange-6251823.pdf; ComponentLink10URL: https://datasheet.ciiva.com/16449/e412-c-16449599.pdf; ComponentLink10Description: https://datasheet.ciiva.com/16449/e412-c-16449599.pdf; Supplier Part Number 1: 445-4116-1-ND
C18 = C2012X7R1A106K125AC: CAP CER 10UF 10V X7R 0805; Manufacturer 1: TDK; Dielectric Material: Ceramic; Tolerance: 10%; Supplier 1: Digi-Key; Manufacturer Part Number 1: C2012X7R1A106K125AC; Stock 1: 20000; Pricing 1: 1=0.52, 10=0.359, 100=0.2156, 500=0.16172, 1000=0.13656 (USD); Mount: Surface Mount; Case/Package: 0805; Number of Pins: 2; Weight: 0.000194oz; Case Code (Metric): 2012; Case Code (Imperial): 0805; Contact Plating: Matte,Tin; Min Operating Temperature: -55°C; Max Operating Temperature: 125°C; Capacitance: 10uF; Dielectric: X7R; Voltage Rating: 10V; Packaging: Tape and Reel; Voltage Rating (DC): 10V; Termination: SMD/SMT; Package Quantity: 1; Composition: Ceramic; Voltage: 10V; Length: 2mm; Height: 1.25mm; Width: 0.049inch; Depth: 1.25mm; Thickness: 0.057inch; Radiation Hardening: No; Lead Free: Lead Free; REACH SVHC: No SVHC; Supplier Part Number 1: 445-6857-1-ND
L1 = IHLP1212AEERR47M11: FIXED IND 470NH 6.7A 15 MOHM SMD; Manufacturer 1: Vishay Dale; Core Material: Ferrite; Tolerance: 20%; Self Resonant Frequency: 1MHz; Shielding: Shielded; DC Resistance (DCR): 15mR; Test Frequency: 100kHz; Supplier 1: Digi-Key; Manufacturer Part Number 1: IHLP1212AEERR47M11; Stock 1: 27366; Pricing 1: 1=1.41, 10=1.308, 100=0.9459, 500=0.7245, 1000=0.644 (USD); Mount: Surface Mount; Case/Package: 1212; Number of Pins: 2; Min Operating Temperature: -55°C; Max Operating Temperature: 125°C; Packaging: Tape and Reel; Inductance Tolerance: 20%; Package Quantity: 3000; Current Rating: 6.7A; Saturation Current: 6.7A; Inductance: 470nh; Max DC Current: 6.7A; Termination: SMD/SMT; RMS Current (Irms): 6.7A; Military Standard: Not; Length: 3.6mm; Height: 1.2mm; Width: 3mm; Height - Seated (Max): 0.059inch; Depth: 3.2mm; Radiation Hardening: No; REACH SVHC: Unknown; Lead Free: Lead Free; Supplier Part Number 1: 541-1330-1-ND
R1 = RMCF0402FT453K: RES SMD 453K OHM 1% 1/16W 0402; Manufacturer: Stackpole Electronics; Resistance: 453kR; Max Power Dissipation: 63mW; Temperature Coefficient: 100ppm/°C; Supplier 1: Digi-Key; Manufacturer Part Number: RMCF0402FT453K; Stock 1: 49261; Pricing 1: 1=0.10000, 10=0.01500, 100=0.00610, 1000=0.00275, 2500=0.00239, 5000=0.00198 (USD); RoHS: Yes; Mount: Surface Mount; Case/Package: 0402; Case Code (Metric): 1005; Case Code (Imperial): 0402; Contact Plating: Tin,Matte; Min Operating Temperature: -55°C; Max Operating Temperature: 155°C; Tolerance: 1%; Packaging: Tape and Reel; Composition: Thick Film; Number of Terminations: 2; Features: Automotive AEC-Q200; Length: 0.039inch; Height: 0.016inch; Width: 0.02inch; ComponentLink1URL: https://www.seielect.com/catalog/SEI-Packaging.pdf?src-supplier=Digi-Key; ComponentLink1Description: https://www.seielect.com/catalog/SEI-Packaging.pdf?src-supplier=Digi-Key; ComponentLink2URL: http://components.arrow.com/part/dataview/47827349S9775272N1174?src-supplier=Arrow; ComponentLink2Description: http://components.arrow.com/part/dataview/47827349S9775272N1174?src-supplier=Arrow; ComponentLink3URL: https://www.seielect.com/Catalog/SEI-RMCF_RMCP.pdf?src-supplier=Avnet; ComponentLink3Description: https://www.seielect.com/Catalog/SEI-RMCF_RMCP.pdf?src-supplier=Avnet; Supplier Part Number 1: RMCF0402FT453KCT-ND
R2 R3 = RC0402FR-07100KL: as R4 on sheet [1]-SOM-G3399; Supplier 1: Digi-Key; Manufacturer Part Number 1: RC0402FR-07100KL; Description 1: RES SMD 100K OHM 1% 1/16W 0402; Stock 1: 10691398; Pricing 1: 1=0.1, 10=0.014, 100=0.0056, 1000=0.0025, 2500=0.0022, 5000=0.0018 (USD); Termination Style: SMD/SMT; Product: Thick Film Resistors General Purpose; Tolerance: 1 %; Case Code - in: 0402; Case Code - mm: 1005; Series: RC; Operating Temperature Range: - 55 C to + 155 C; Packaging: Reel; ComponentLink1URL: https://datasheet.ciiva.com/11819/0900766b80c66297-11819452.pdf; ComponentLink1Description: https://datasheet.ciiva.com/11819/0900766b80c66297-11819452.pdf; ComponentLink2URL: https://datasheet.ciiva.com/16740/pyu-rc0402-51-rohs-l-6-r-16740567.pdf; ComponentLink2Description: https://datasheet.ciiva.com/16740/pyu-rc0402-51-rohs-l-6-r-16740567.pdf; ComponentLink3URL: https://datasheet.ciiva.com/12667/pyu-rc0402-51-rohs-l-6-r-12667930.pdf; ComponentLink3Description: https://datasheet.ciiva.com/12667/pyu-rc0402-51-rohs-l-6-r-12667930.pdf; ComponentLink4URL: https://datasheet.ciiva.com/2453/pyu-r-int-thick-7-2453361.pdf; ComponentLink4Description: https://datasheet.ciiva.com/2453/pyu-r-int-thick-7-2453361.pdf; ComponentLink5URL: https://datasheet.ciiva.com/15189/getdatasheetpartid-323696-15189334.pdf; ComponentLink5Description: https://datasheet.ciiva.com/15189/getdatasheetpartid-323696-15189334.pdf; ComponentLink6URL: https://datasheet.ciiva.com/2453/pyu-r-int-thick-7-2453362.pdf; ComponentLink6Description: https://datasheet.ciiva.com/2453/pyu-r-int-thick-7-2453362.pdf; ComponentLink7URL: https://datasheet.ciiva.com/2453/pyu-r-int-thick-7-2453363.pdf; ComponentLink7Description: https://datasheet.ciiva.com/2453/pyu-r-int-thick-7-2453363.pdf; ComponentLink8URL: https://datasheet.ciiva.com/22747/1018594-22747509.pdf; ComponentLink8Description: https://datasheet.ciiva.com/22747/1018594-22747509.pdf; Supplier Part Number 1: 311-100KLRCT-ND
U1 = IC_TPS62825DMQR: IC STEP DOWN CONV 1-5V 2A QFN; Manufacturer 1: Texas Instruments; Supplier 1: Digi-Key; Manufacturer Part Number 1: TPS62825DMQR; Stock 1: 1427; Pricing 1: 1=1.56, 10=1.392, 100=1.085, 500=0.8963, 1000=0.70761 (USD); Supplier Part Number 1: 296-49521-1-ND

## Nets that join several sheets
+3V3: [1]-SOM-G3399 (13 pins), [3]-DCDC-3V3 (C16.2 C18.2 L1.2 R1.2)
+5V: [1]-SOM-G3399 (C10.2 C12.2 U4.14 U5.14), [2]-INTERFACE_CONNS (P2.53 P2.55 P2.57 P2.59), [3]-DCDC-3V3 (C17.2 R2.1 U1.1 U1.6)
GND: [1]-SOM-G3399 (21 pins), [2]-INTERFACE_CONNS (23 pins), [3]-DCDC-3V3 (C17.1 C18.1 R3.1 U1.4)
CHAIN_UART_DE: [1]-SOM-G3399 (U2.187), [2]-INTERFACE_CONNS (P2.56)
CHAIN_UART_RE: [1]-SOM-G3399 (U2.186), [2]-INTERFACE_CONNS (P2.52)
CHAIN_UART_RX: [1]-SOM-G3399 (U2.198), [2]-INTERFACE_CONNS (P2.54)
CHAIN_UART_TX: [1]-SOM-G3399 (U2.199), [2]-INTERFACE_CONNS (P2.58)
CLI_UART_RX: [1]-SOM-G3399 (U2.44), [2]-INTERFACE_CONNS (P2.13)
CLI_UART_TX: [1]-SOM-G3399 (U2.45), [2]-INTERFACE_CONNS (P2.15)
CODEC_I2C_SCL: [1]-SOM-G3399 (U2.2), [2]-INTERFACE_CONNS (P3.11)
CODEC_I2C_SDA: [1]-SOM-G3399 (U2.1), [2]-INTERFACE_CONNS (P3.13)
CODEC_I2S_BCLK: [1]-SOM-G3399 (U2.9), [2]-INTERFACE_CONNS (P3.19)
CODEC_I2S_LRCK: [1]-SOM-G3399 (U2.11), [2]-INTERFACE_CONNS (P3.17)
CODEC_I2S_MCLK: [1]-SOM-G3399 (U2.8), [2]-INTERFACE_CONNS (P3.15)
CODEC_I2S_SDIN: [1]-SOM-G3399 (U2.14), [2]-INTERFACE_CONNS (P3.25)
CODEC_I2S_SDOUT: [1]-SOM-G3399 (U2.12), [2]-INTERFACE_CONNS (P3.23)
CODEC_I2S_SPDIF_SDIN: [1]-SOM-G3399 (U2.15), [2]-INTERFACE_CONNS (P3.27)
CODEC_MUTEC: [1]-SOM-G3399 (U2.35), [2]-INTERFACE_CONNS (P3.29)
CODEC_RESET: [1]-SOM-G3399 (U2.31), [2]-INTERFACE_CONNS (P3.9)
CV_ADC_CS: [1]-SOM-G3399 (U2.188), [2]-INTERFACE_CONNS (P3.28)
CV_ADC_DIN: [1]-SOM-G3399 (U2.195), [2]-INTERFACE_CONNS (P3.16 P3.22)
CV_ADC_DOUT: [1]-SOM-G3399 (U2.194), [2]-INTERFACE_CONNS (P3.24)
CV_ADC_SCLK: [1]-SOM-G3399 (U2.189), [2]-INTERFACE_CONNS (P3.18 P3.26)
CV_DAC_CS: [1]-SOM-G3399 (U2.185), [2]-INTERFACE_CONNS (P3.14)
CV_IN_BIAS: [1]-SOM-G3399 (U2.29), [2]-INTERFACE_CONNS (P2.45)
CV_IN_DET: [1]-SOM-G3399 (U5.13), [2]-INTERFACE_CONNS (P2.47)
CV_OUT_BIAS: [1]-SOM-G3399 (U2.41), [2]-INTERFACE_CONNS (P3.10)
EXP_EN1: [1]-SOM-G3399 (U2.181), [2]-INTERFACE_CONNS (P3.38)
EXP_EN2: [1]-SOM-G3399 (U2.184), [2]-INTERFACE_CONNS (P3.32)
EXP_FLAG1: [1]-SOM-G3399 (U5.11), [2]-INTERFACE_CONNS (P3.36)
EXP_FLAG2: [1]-SOM-G3399 (U5.12), [2]-INTERFACE_CONNS (P3.34)
HMI_ISP_ENABLE: [1]-SOM-G3399 (U2.46), [2]-INTERFACE_CONNS (P2.35)
HMI_ISP_RESET: [1]-SOM-G3399 (U2.47), [2]-INTERFACE_CONNS (P2.37)
HMI_ISP_UART_RX: [1]-SOM-G3399 (U2.183), [2]-INTERFACE_CONNS (P2.41)
HMI_ISP_UART_TX: [1]-SOM-G3399 (U2.193), [2]-INTERFACE_CONNS (P2.39)
HMI_RFU_UART_RX: [1]-SOM-G3399 (U3.11), [2]-INTERFACE_CONNS (P2.21)
HMI_RFU_UART_TX: [1]-SOM-G3399 (U3.10), [2]-INTERFACE_CONNS (P2.19)
HP_CLOCK: [1]-SOM-G3399 (U2.27), [2]-INTERFACE_CONNS (P3.2)
HP_DISABLE: [1]-SOM-G3399 (U2.40), [2]-INTERFACE_CONNS (P3.8)
HP_UP/DW: [1]-SOM-G3399 (U2.30), [2]-INTERFACE_CONNS (P3.4)
IN1_DETECT: [1]-SOM-G3399 (U4.11), [2]-INTERFACE_CONNS (P2.38)
IN1_GC1: [1]-SOM-G3399 (U2.197), [2]-INTERFACE_CONNS (P3.35)
IN1_GC2: [1]-SOM-G3399 (U2.196), [2]-INTERFACE_CONNS (P3.33)
IN1_TBP: [1]-SOM-G3399 (U2.48), [2]-INTERFACE_CONNS (P3.3)
IN2_DETECT: [1]-SOM-G3399 (U4.10), [2]-INTERFACE_CONNS (P2.40)
IN2_GC1: [1]-SOM-G3399 (U2.191), [2]-INTERFACE_CONNS (P3.37)
IN2_GC2: [1]-SOM-G3399 (U2.192), [2]-INTERFACE_CONNS (P3.39)
IN2_TBP: [1]-SOM-G3399 (U2.36), [2]-INTERFACE_CONNS (P3.5)
MIDI_UART_RX: [1]-SOM-G3399 (U3.12), [2]-INTERFACE_CONNS (P2.20)
MIDI_UART_TX: [1]-SOM-G3399 (U3.13), [2]-INTERFACE_CONNS (P2.18)
OUT1_DETECT: [1]-SOM-G3399 (U4.13), [2]-INTERFACE_CONNS (P2.32)
OUT2_DETECT: [1]-SOM-G3399 (U4.12), [2]-INTERFACE_CONNS (P2.34)
PM_LEDS_OE: [1]-SOM-G3399 (U2.190), [2]-INTERFACE_CONNS (P2.7)
PM_LEDS_SCL: [1]-SOM-G3399 (U2.155), [2]-INTERFACE_CONNS (P2.5)
PM_LEDS_SDA: [1]-SOM-G3399 (U2.156), [2]-INTERFACE_CONNS (P2.3)
PWR_BUTTON: [1]-SOM-G3399 (U2.37), [2]-INTERFACE_CONNS (P2.9)
UBOOT_BUTTON: [1]-SOM-G3399 (U2.124), [2]-INTERFACE_CONNS (P2.14)
USB_DEV_D_N: [1]-SOM-G3399 (U2.105), [2]-INTERFACE_CONNS (P2.26)
USB_DEV_D_P: [1]-SOM-G3399 (U2.106), [2]-INTERFACE_CONNS (P2.28)
USB_DEV_DET: [1]-SOM-G3399 (U2.123), [2]-INTERFACE_CONNS (P2.24)
USB_HOST_D_N: [1]-SOM-G3399 (U2.113), [2]-INTERFACE_CONNS (P2.42)
USB_HOST_D_P: [1]-SOM-G3399 (U2.114), [2]-INTERFACE_CONNS (P2.44)
USB_HOST_DRV: [1]-SOM-G3399 (U5.10), [2]-INTERFACE_CONNS (P2.48)

## Assembly variants
PROTO: all parts fitted